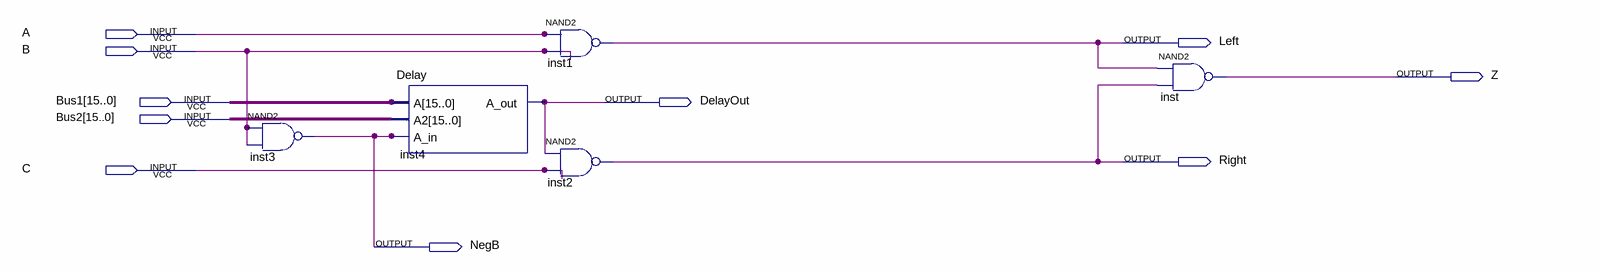
[diagram p0: schematic sheet]
// Quartus schematic lab1_with_hazard.bdf as structural Verilog: 5 symbols, 10 pins
module lab1_with_hazard (
  input  A,
  input  B,
  input  [15:0] Bus1,
  input  [15:0] Bus2,
  input  C,
  output Left,
  output Z,
  output DelayOut,
  output Right,
  output NegB
);

  nand inst3 (NegB, B, B);
  Delay inst4 (.A(Bus1), .A2(Bus2), .A_in(NegB), .A_out(DelayOut));
  nand inst1 (Left, A, B);
  nand inst2 (Right, DelayOut, C);
  nand inst (Z, Left, Right);
endmodule
